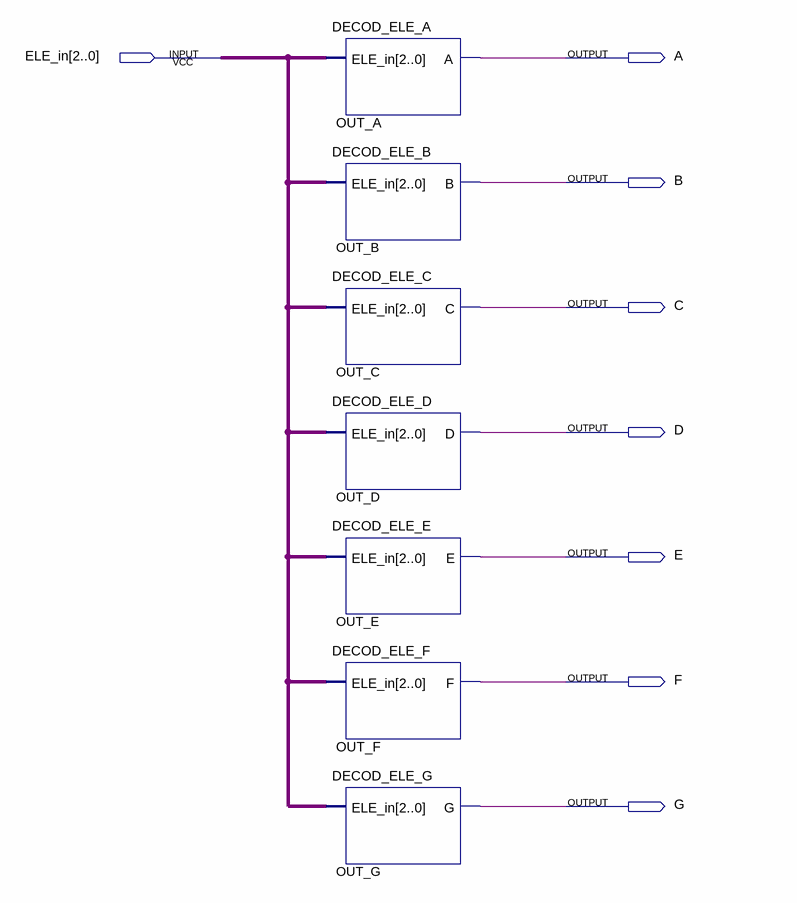
[diagram p0: schematic sheet]
// Quartus schematic DECOD_ELE_3b.bdf as structural Verilog: 7 symbols, 8 pins
module DECOD_ELE_3b (
  input  [2:0] ELE_in,
  output A,
  output B,
  output C,
  output D,
  output E,
  output F,
  output G
);

  DECOD_ELE_A OUT_A (.ELE_in(ELE_in), .A(A));
  DECOD_ELE_B OUT_B (.ELE_in(ELE_in), .B(B));
  DECOD_ELE_C OUT_C (.ELE_in(ELE_in), .C(C));
  DECOD_ELE_D OUT_D (.ELE_in(ELE_in), .D(D));
  DECOD_ELE_E OUT_E (.ELE_in(ELE_in), .E(E));
  DECOD_ELE_F OUT_F (.ELE_in(ELE_in), .F(F));
  DECOD_ELE_G OUT_G (.ELE_in(ELE_in), .G(G));
endmodule
